# EAGLE design bluetoothbm20breakout (EAGLE 9.6.2)
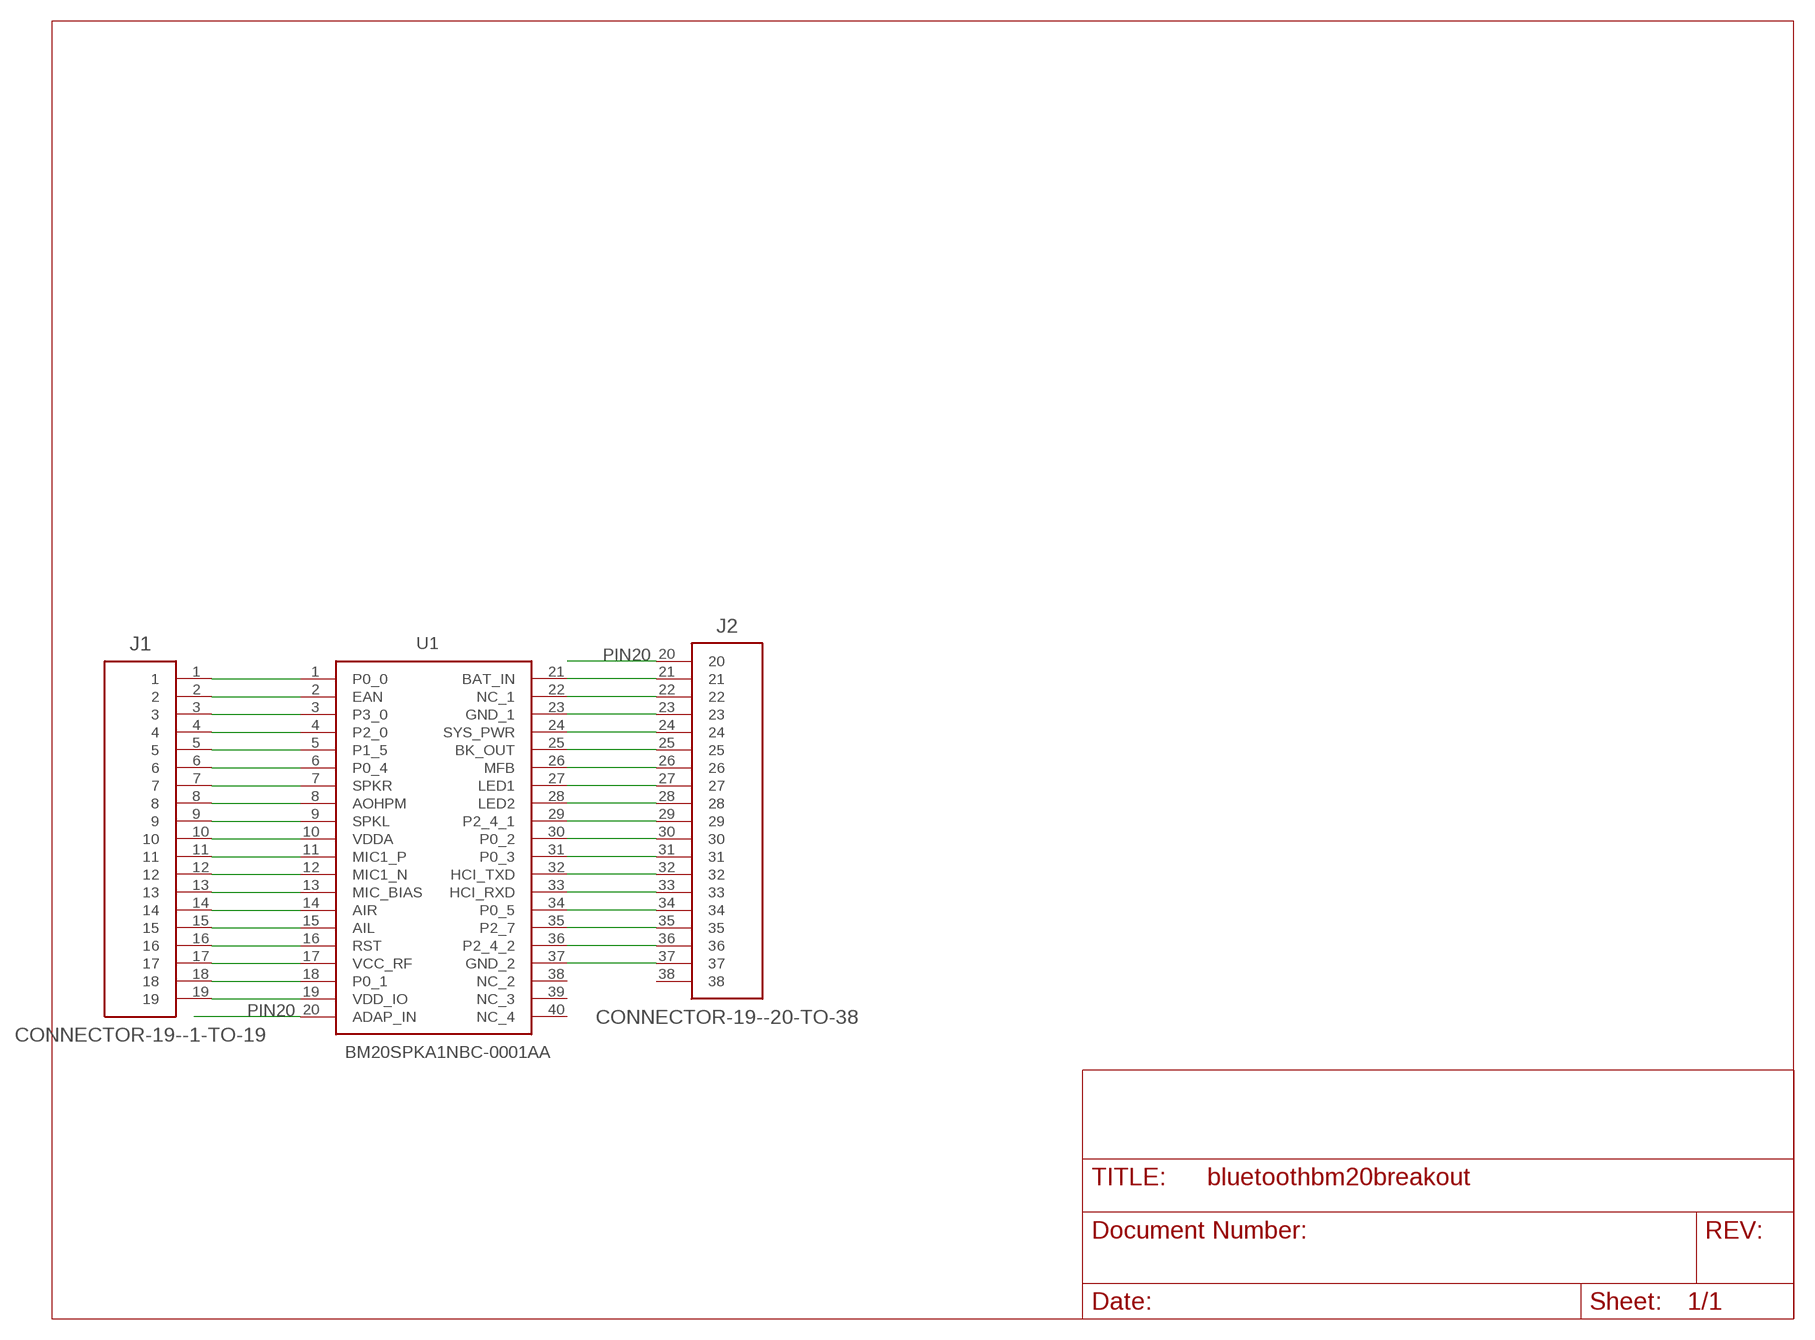
[diagram p0: schematic, sheet 1]

## Parts
J1  CONNECTOR-19--1-TO-19  [ESQ-119-XX-XX-S]
J2  CONNECTOR-19--20-TO-38  [ESQ-119-XX-XX-S--PIN-1-ROUND]
U1  BM20SPKA1NBC-0001AA  [BM20SPKA1NBC0001AA]

## Nets
N$1: J1.4 U1.4(P2_0)
N$2: J1.1 U1.1(P0_0)
N$3: J1.5 U1.5(P1_5)
N$4: J1.2 U1.2(EAN)
N$5: J1.6 U1.6(P0_4)
N$6: J1.3 U1.3(P3_0)
N$7: J1.7 U1.7(SPKR)
N$8: J1.8 U1.8(AOHPM)
N$9: J1.9 U1.9(SPKL)
N$10: J1.10 U1.10(VDDA)
N$11: J1.11 U1.11(MIC1_P)
N$12: J1.12 U1.12(MIC1_N)
N$13: J1.13 U1.13(MIC_BIAS)
N$14: J1.14 U1.14(AIR)
N$15: J1.15 U1.15(AIL)
N$16: J1.16 U1.16(RST)
N$17: J1.17 U1.17(VCC_RF)
N$18: J1.18 U1.18(P0_1)
N$19: J1.19 U1.19(VDD_IO)
N$20: J2.23 U1.23(GND_1)
N$21: J2.24 U1.24(SYS_PWR)
N$22: J2.21 U1.21(BAT_IN)
N$23: J2.25 U1.25(BK_OUT)
N$24: J2.22 U1.22(NC_1)
N$25: J2.26 U1.26(MFB)
N$26: J2.27 U1.27(LED1)
N$27: J2.28 U1.28(LED2)
N$28: J2.29 U1.29(P2_4_1)
N$29: J2.30 U1.30(P0_2)
N$30: J2.31 U1.31(P0_3)
N$31: J2.32 U1.32(HCI_TXD)
N$32: J2.33 U1.33(HCI_RXD)
N$33: J2.34 U1.34(P0_5)
N$34: J2.35 U1.35(P2_7)
N$35: J2.36 U1.36(P2_4_2)
N$36: J2.37 U1.37(GND_2)
PIN20: J2.20 U1.20(ADAP_IN)
Unconnected: J2.38 U1.38(NC_2) U1.39(NC_3) U1.40(NC_4)

## Library data of the parts
J1 = eagle-library-engr-245-s22:CONNECTOR-19--1-TO-19
J2 = eagle-library-engr-245-s22:CONNECTOR-19--20-TO-38
U1 = eagle-library-engr-245-s22:BM20SPKA1NBC-0001AA: Bluetooth Modules (802.15.1) BT 4.1 Stereo Audio No-Shield/Antenna Source: Datasheet <https://componentsearchengine.com/Datasheets/1/BM20SPKA1NBC-0001AA.pdf>; DESCRIPTION: Bluetooth Modules (802.15.1) BT 4.1 Stereo Audio No-Shield/Antenna; HEIGHT: 2.5mm; MANUFACTURER_NAME: Microchip; MANUFACTURER_PART_NUMBER: BM20SPKA1NBC-0001AA; MOUSER_PART_NUMBER: 579-SPKA1NBC-0001AA; MOUSER_PRICE-STOCK: https://www.mouser.co.uk/ProductDetail/Microchip-Technology/BM20SPKA1NBC-0001AA?qs=uus7iwvxYD8HqvnWsd76VQ%3D%3D

## Board
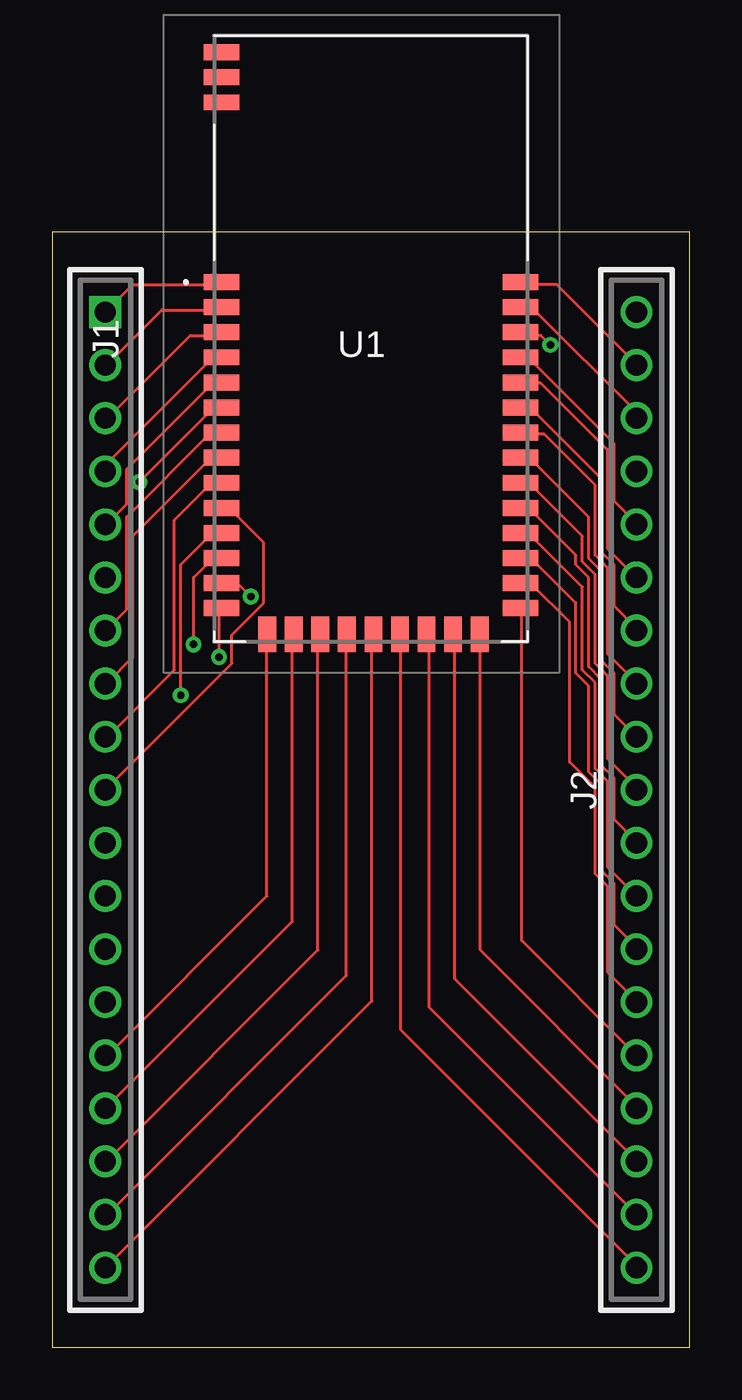
[diagram p1: board, top side]
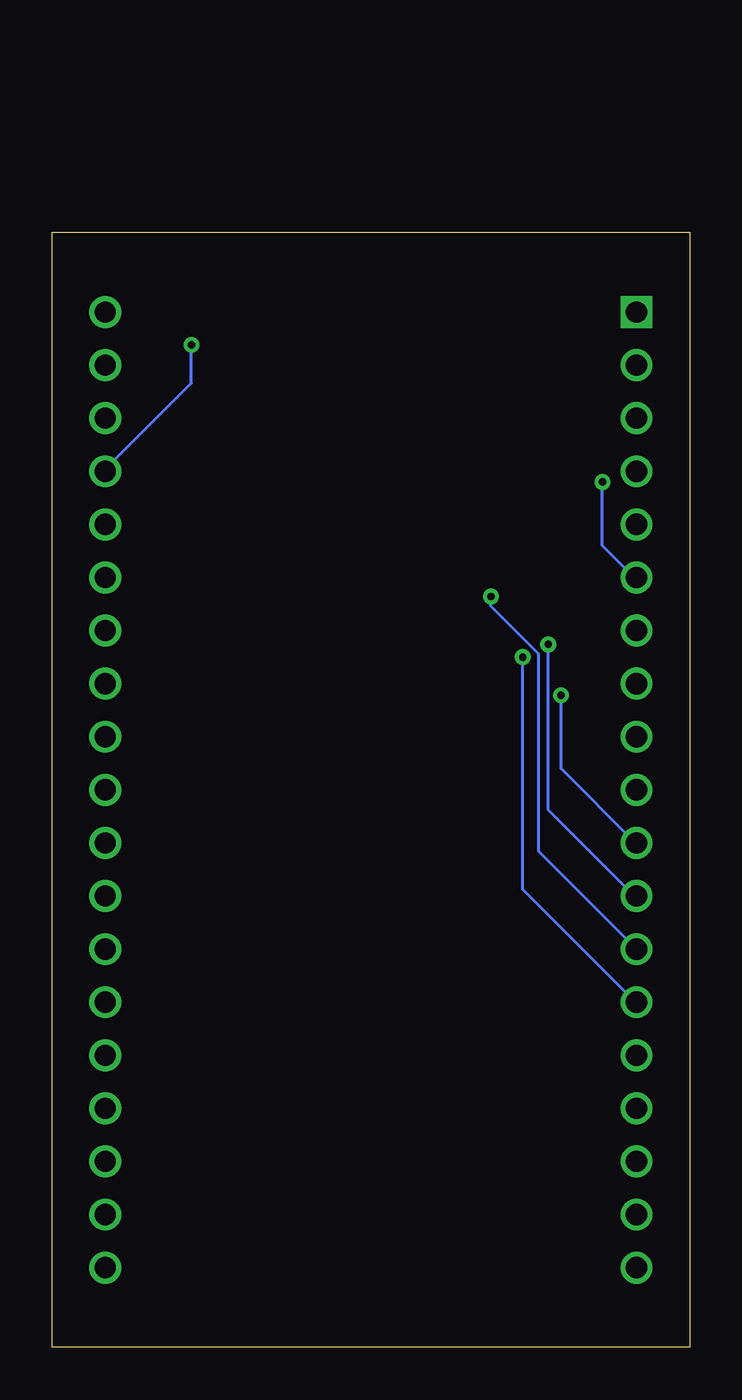
[diagram p2: board, bottom side, seen from below]

Size 30.48 x 53.34 mm. Coordinates in mm from the lower left corner, seen from the top.
Outline: 0,0 30.48,0 30.48,53.34 0,53.34 0,0
Copper layers (1*16): Top 0.035mm / dielectric 1.5mm / Bottom 0.035mm
Design rules "default": minimum track width 6mil, minimum drill 0.35mm, track to track 6mil, track to pad 6mil, pad to pad 6mil, via to via 6mil, smd to smd 6mil, copper to edge 40mil, drill to drill 6mil, minimum pad ring 10mil, minimum via ring 8mil, stop-mask expansion 4mil, vias tented up to drill 0mil, thermal gap 10mil

### Footprints (pad centres in the part's own frame; a part is rotated, then mirrored left to right if it is on the bottom)
ESQ-119-XX-XX-S = drill 1.016 pad 1.524 square: 1 0,0 | drill 1.016 pad 1.524: 2 2.54,0; 3 5.08,0; 4 7.62,0; 5 10.16,0; 6 12.7,0; 7 15.24,0; 8 17.78,0; 9 20.32,0; 10 22.86,0; 11 25.4,0; 12 27.94,0; 13 30.48,0; 14 33.02,0; 15 35.56,0; 16 38.1,0; 17 40.64,0; 18 43.18,0; 19 45.72,0
ESQ-119-XX-XX-S--PIN-1-ROUND = drill 1.016 pad 1.524: 20 -22.86,0; 21 -20.32,0; 22 -17.78,0; 23 -15.24,0; 24 -12.7,0; 25 -10.16,0; 26 -7.62,0; 27 -5.08,0; 28 -2.54,0; 29 0,0; 30 2.54,0; 31 5.08,0; 32 7.62,0; 33 10.16,0; 34 12.7,0; 35 15.24,0; 36 17.78,0; 37 20.32,0; 38 22.86,0
BM20SPKA1NBC0001AA = smd 1.7 x 0.76: 1 -7.15,2.7; 2 -7.15,1.5; 3 -7.15,0.3; 4 -7.15,-0.9; 5 -7.15,-2.1; 6 -7.15,-3.3; 7 -7.15,-4.5; 8 -7.15,-5.7; 9 -7.15,-6.9; 10 -7.15,-8.1; 11 -7.15,-9.3; 12 -7.15,-10.5; 13 -7.15,-11.7; 14 -7.15,-12.9; 24 7.15,-12.9; 25 7.15,-11.7; 26 7.15,-10.5; 27 7.15,-9.3; 28 7.15,-8.1; 29 7.15,-6.9; 30 7.15,-5.7; 31 7.15,-4.5; 32 7.15,-3.3; 33 7.15,-2.1; 34 7.15,-0.9; 35 7.15,0.3; 36 7.15,1.5; 37 7.15,2.7; 38 -7.15,13.7; 39 -7.15,12.5; 40 -7.15,11.3 | smd 0.85 x 1.7: 15 -4.96,-14.15; 16 -3.69,-14.15; 17 -2.42,-14.15; 18 -1.15,-14.15; 19 0.12,-14.15; 20 1.39,-14.15; 21 2.66,-14.15; 22 3.93,-14.15; 23 5.2,-14.15

### Placement (x,y rotation side)
J1  2.54,49.53 270 top
J2  27.94,26.67 90 top
U1  15.24,48.26 0 top

### Tracks (layer width: path | path; a pad name or v marks a point on that pad's centre or on a via)
N$1
  Top 0.152: U1.4 7.98,47.35 7.67,47.35 2.64,42.32 2.64,42.01 J1.4
N$2
  Top 0.152: J1.1 3.86,50.85 7.98,50.85 U1.1
N$3
  Top 0.152: U1.5 7.98,46.13 7.67,46.13 3.56,42.01 3.56,40.34 2.64,39.42 J1.5
N$4
  Top 0.152: U1.2 7.98,49.63 5.23,49.63 2.64,47.04 J1.2
N$5  (via drill 0.35)
  Top 0.152: v4.17,41.4 7.67,44.91 7.98,44.91 U1.6
  Bottom 0.152: v4.17,41.4 4.17,38.35 2.64,36.83 J1.6
N$6
  Top 0.152: U1.3 7.98,48.41 6.6,48.41 2.64,44.45 J1.3
N$7
  Top 0.152: J1.7 3.56,35.31 3.56,39.73 7.52,43.69 7.98,43.69 U1.7
N$8
  Top 0.152: U1.8 7.98,42.47 7.52,42.47 3.86,38.81 3.86,33.02 2.64,31.8 J1.8
N$9
  Top 0.152: U1.9 7.98,41.25 7.52,41.25 5.84,39.57 5.84,32.41 2.64,29.21 J1.9
N$10
  Top 0.152: J1.10 8.59,32.72 8.59,34.09 10.11,35.61 10.11,38.51 8.59,40.03 8.13,40.03 U1.10
N$11  (via drill 0.35)
  Top 0.152: v6.15,31.19 6.15,37.44 7.52,38.81 7.98,38.81 U1.11
  Bottom 0.152: v6.15,31.19 6.15,27.69 2.64,24.18 J1.11
N$12  (via drill 0.35)
  Top 0.152: v6.76,33.63 6.76,36.83 7.67,37.74 7.98,37.74 U1.12
  Bottom 0.152: v6.76,33.63 6.76,25.7 2.64,21.59 J1.12
N$13  (via drill 0.35)
  Top 0.152: v9.5,35.92 8.89,36.52 8.13,36.52 U1.13
  Bottom 0.152: v9.5,35.92 9.5,35.46 7.21,33.17 7.21,23.72 J1.13
N$14  (via drill 0.35)
  Top 0.152: v7.98,33.02 7.98,35.31 U1.14
  Bottom 0.152: v7.98,33.02 7.98,21.89 2.64,16.56 J1.14
N$15
  Top 0.152: U1.15 10.26,34.09 10.26,21.59 2.64,13.97 J1.15
N$16
  Top 0.152: J1.16 11.48,20.37 11.48,34.09 U1.16
N$17
  Top 0.152: U1.17 12.7,34.09 12.7,19 2.64,8.94 J1.17
N$18
  Top 0.152: U1.18 14.07,34.09 14.07,17.78 2.64,6.35 J1.18
N$19
  Top 0.152: J1.19 15.29,16.56 15.29,34.09 U1.19
N$20
  Top 0.152: U1.23 20.47,34.09 20.47,19 27.94,11.53 J2.23
N$21
  Top 0.152: J2.24 22.45,19.46 22.45,35.31 U1.24
N$22
  Top 0.152: J2.21 18.03,16.26 18.03,34.09 U1.21
N$23
  Top 0.152: U1.25 22.45,36.52 22.91,36.52 24.74,34.7 24.74,27.99 25.96,26.77 25.96,22.66 26.57,22.05 26.57,17.93 27.94,16.56 J2.25
N$24
  Top 0.152: U1.22 19.25,34.09 19.25,17.63 27.94,8.94 J2.22
N$25
  Top 0.152: U1.26 22.45,37.74 22.91,37.74 25.04,35.61 25.04,32.26 25.65,31.65 25.65,27.53 26.26,26.92 26.26,22.81 26.87,22.2 26.87,20.22 27.94,19.15 J2.26
N$26
  Top 0.152: J2.27 26.57,22.96 26.57,27.08 25.96,27.69 25.96,31.8 25.35,32.41 25.35,36.37 22.91,38.81 22.45,38.81 U1.27
N$27
  Top 0.152: U1.28 22.45,40.03 22.91,40.03 25.04,37.9 25.04,37.44 25.65,36.83 25.65,32.56 26.26,31.95 26.26,27.84 26.87,27.23 26.87,25.25 27.94,24.18 J2.28
N$28
  Top 0.152: U1.29 22.45,41.25 22.91,41.25 25.35,38.81 25.35,37.59 25.96,36.98 25.96,32.72 26.57,32.11 26.57,28.14 27.94,26.77 J2.29
N$29
  Top 0.152: J2.30 26.87,30.28 26.87,32.26 26.26,32.87 26.26,37.13 25.65,37.74 25.65,39.73 22.91,42.47 22.45,42.47 U1.30
N$30
  Top 0.152: U1.31 22.45,43.69 23.52,43.69 25.96,41.25 25.96,37.9 26.57,37.29 26.57,33.17 27.94,31.8 J2.31
N$31
  Top 0.152: U1.32 22.45,44.91 22.91,44.91 26.26,41.55 26.26,38.05 26.87,37.44 26.87,35.46 27.94,34.39 J2.32
N$32
  Top 0.152: J2.33 26.57,38.2 26.57,42.93 23.37,46.13 22.45,46.13 U1.33
N$33
  Top 0.152: U1.34 22.45,47.35 22.76,47.35 26.87,43.23 26.87,40.49 27.94,39.42 J2.34
N$34  (via drill 0.35)
  Top 0.152: v23.82,47.95 23.37,48.41 22.45,48.41 U1.35
  Bottom 0.152: v23.82,47.95 23.82,46.13 27.94,42.01 J2.35
N$35
  Top 0.152: J2.36 27.94,44.76 23.06,49.63 22.45,49.63 U1.36
N$36
  Top 0.152: U1.37 22.45,50.85 24.13,50.85 27.94,47.04 J2.37
PIN20
  Top 0.152: U1.20 16.66,34.09 16.66,15.19 27.94,3.91 J2.20